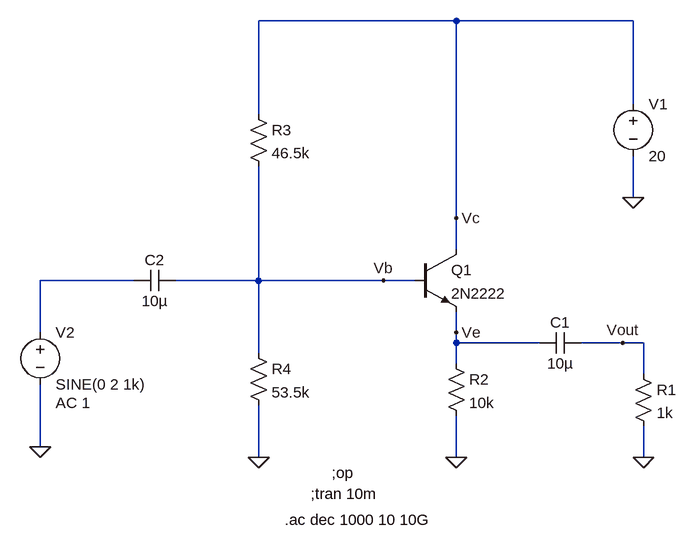
[diagram p0: schematic CC Amplifier.asc]
CC Amplifier.asc, the LTspice schematic file:
Version 4
SHEET 1 880 680
WIRE 272 -224 -32 -224
WIRE 544 -224 272 -224
WIRE 544 -96 544 -224
WIRE -32 -80 -32 -224
WIRE 544 48 544 -16
WIRE 272 80 272 -224
WIRE 272 128 272 80
WIRE -224 176 -368 176
WIRE -32 176 -32 0
WIRE -32 176 -160 176
WIRE 160 176 -32 176
WIRE 208 176 160 176
WIRE -368 256 -368 176
WIRE 272 256 272 224
WIRE 272 272 272 256
WIRE 400 272 272 272
WIRE 528 272 464 272
WIRE 560 272 528 272
WIRE -32 288 -32 176
WIRE 272 304 272 272
WIRE 560 320 560 272
WIRE -368 432 -368 336
WIRE -32 448 -32 368
WIRE 272 448 272 384
WIRE 560 448 560 400
FLAG -32 448 0
FLAG 272 448 0
FLAG 544 48 0
FLAG -368 432 0
FLAG 560 448 0
FLAG 160 176 Vb
FLAG 272 80 Vc
FLAG 272 256 Ve
FLAG 528 272 Vout
SYMBOL npn 208 128 R0
SYMATTR InstName Q1
SYMATTR Value 2N2222
SYMBOL res 256 288 R0
SYMATTR InstName R2
SYMATTR Value 10k
SYMBOL res -48 -96 R0
SYMATTR InstName R3
SYMATTR Value 46.5k
SYMBOL res -48 272 R0
SYMATTR InstName R4
SYMATTR Value 53.5k
SYMBOL voltage 544 -112 R0
WINDOW 123 0 0 Left 0
WINDOW 39 0 0 Left 0
SYMATTR InstName V1
SYMATTR Value 20
SYMBOL cap 464 256 R90
WINDOW 0 0 32 VBottom 2
WINDOW 3 32 32 VTop 2
SYMATTR InstName C1
SYMATTR Value 10µ
SYMBOL cap -160 160 R90
WINDOW 0 0 32 VBottom 2
WINDOW 3 32 32 VTop 2
SYMATTR InstName C2
SYMATTR Value 10µ
SYMBOL voltage -368 240 R0
WINDOW 123 24 124 Left 2
WINDOW 39 0 0 Left 0
SYMATTR Value2 AC 1
SYMATTR InstName V2
SYMATTR Value SINE(0 2 1k)
SYMBOL res 544 304 R0
SYMATTR InstName R1
SYMATTR Value 1k
TEXT 80 472 Left 2 !;op
TEXT 48 504 Left 2 !;tran 10m
TEXT 8 544 Left 2 !.ac dec 1000 10 10G

The netlist it stands for:
* CC Amplifier.asc
Q1 Vc Vb Ve 0 2N2222
R2 Ve 0 10k
R3 Vc Vb 46.5k
R4 Vb 0 53.5k
V1 Vc 0 20
C1 Vout Ve 10µ
C2 Vb N001 10µ
V2 N001 0 SINE(0 2 1k) AC 1
R1 Vout 0 1k
.model NPN NPN
.model PNP PNP
.lib standard.bjt
;op
;tran 10m
.ac dec 1000 10 10G
.backanno
.end

* Results of the author's LTspice run, read from the files saved beside the schematic
* Operating Point, zero values left out:
*   V(vc) = 20 V
*   V(vb) = 10.59 V
*   V(ve) = 9.934 V
*   Ic(Q1) = 988.9 µA
*   Ib(Q1) = 4.533 µA
*   Ie(Q1) = -993.4 µA
*   I(R4) = 197.9 µA
*   I(R3) = 202.4 µA
*   I(R2) = 993.4 µA
*   I(V1) = -1.191 mA
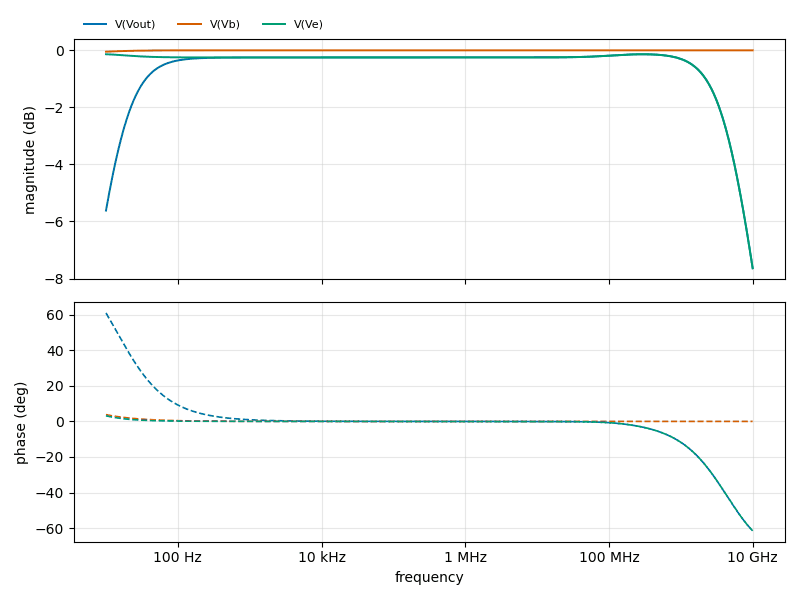
[diagram p1: AC Analysis of CC Amplifier.asc, plotted from the saved traces]
* AC Analysis, 1 run:
*   V(Vout): -5.62 dB at 10 Hz, -7.64 dB at 10 GHz, peak -0.14 dB at 290.4 MHz, 3 dB below the peak at 16.02 Hz and 4.658 GHz
*   V(Vb): -0.05 dB at 10 Hz, -0.00 dB at 10 GHz, peak -0.00 dB at 10 GHz
*   V(Ve): -0.14 dB at 10 Hz, -7.64 dB at 10 GHz, peak -0.14 dB at 10 Hz, 3 dB below the peak at 4.658 GHz